# Altium schematic sheet Schematic_Thesis.SchDoc
size A
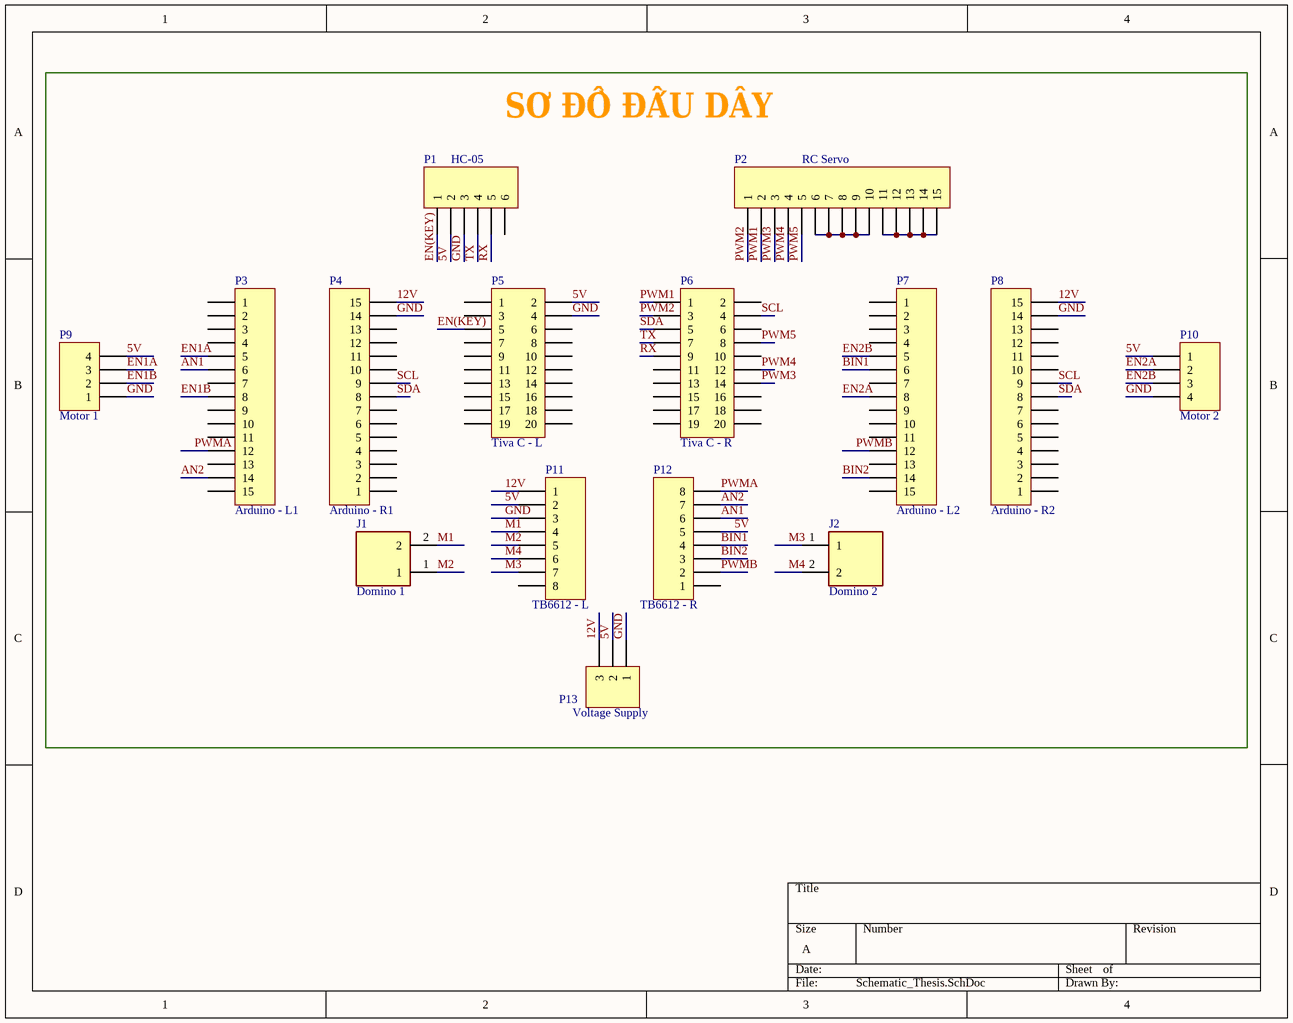
[diagram p0: Schematic_Thesis.SchDoc]

## Parts
J1  Domino 1  [HANDSON_KF301-2P]
J2  Domino 2  [HANDSON_KF301-2P]
P1  HC-05  [HDR1X6]
P2  RC Servo  [HDR1X15]
P3  Arduino - L1  [HDR1X15]
P4  Arduino - R1  [HDR1X15]
P5  Tiva C - L  [HDR2X10]
P6  Tiva C - R  [HDR2X10]
P7  Arduino - L2  [HDR1X15]
P8  Arduino - R2  [HDR1X15]
P9  Motor 1  [HDR1X4]
P10  Motor 2  [HDR1X4]
P11  TB6612 - L  [HDR1X8]
P12  TB6612 - R  [HDR1X8]
P13  Voltage Supply  [HDR1X3]

## Nets
5V: P1.2 P5.2 P9.4 P10.1 P11.2 P12.5 P13.2
12V: P4.15 P8.15 P11.1 P13.3
AN1: P3.6 P12.6
AN2: P3.14 P12.7
BIN1: P7.6 P12.4
BIN2: P7.14 P12.3
EN1A: P3.5 P9.3
EN1B: P3.8 P9.2
EN2A: P7.8 P10.2
EN2B: P7.5 P10.3
EN(KEY): P1.1 P5.5
GND: P1.3 P4.14 P5.4 P8.14 P9.1 P10.4 P11.3 P13.1
M1: J1.2 P11.4
M2: J1.1 P11.5
M3: J2.1 P11.7
M4: J2.2 P11.6
PWM1: P2.2 P6.1
PWM2: P2.1 P6.3
PWM3: P2.3 P6.14
PWM4: P2.4 P6.12
PWM5: P2.5 P6.8
PWMA: P3.12 P12.8
PWMB: P7.12 P12.2
RX: P1.5 P6.9
SCL: P4.9 P6.4 P8.9
SDA: P4.8 P6.5 P8.8
TX: P1.4 P6.7
NetP2_6: P2.6 P2.7 P2.8 P2.9 P2.10
NetP2_11: P2.11 P2.12 P2.13 P2.14 P2.15

Not connected (* = marked no-connect by the designer): P1 6; P3 1 2 3 4 7 9 10 11 13 15; P4 1 2 3 4 5 6 7 10 11 12 13; P5 1 3 6 7 8 9 10 11 12 13 14 15 16 17 18 19 20; P6 2 6 10 11 13 15 16 17 18 19 20; P7 1 2 3 4 7 9 10 11 13 15; P8 1 2 3 4 5 6 7 10 11 12 13; P11 8; P12 1

## Notes on the sheet
- SƠ ĐỒ ĐẤU DÂY

## Library data of the parts
J1 J2 = KF301-2P: 2 Pin Terminal Block 5mm Pitch; MF: Handson Technology; Availability: Unavailable; MP: KF301-2P; Price: None; Value: *; SnapEDA_Link: https://www.snapeda.com/parts/KF301-2P/Handson%20Technology/view-part/4276957/?ref=snap; Package: Package
P1 = Header 6: Header, 6-Pin; LatestRevisionDate: 17-Jul-2002; LatestRevisionNote: Re-released for DXP Platform.; Publisher: Altium Limited
P2-P4 P7 P8 = Header 15: Header, 15-Pin; LatestRevisionDate: 17-Jul-2002; LatestRevisionNote: Re-released for DXP Platform.; Publisher: Altium Limited
P5 P6 = Header 10X2: Header, 10-Pin, Dual row; LatestRevisionDate: 17-Jul-2002; LatestRevisionNote: Re-released for DXP Platform.; Publisher: Altium Limited
P9 P10 = Header 4: Header, 4-Pin; LatestRevisionDate: 17-Jul-2002; LatestRevisionNote: Re-released for DXP Platform.; Publisher: Altium Limited
P11 P12 = Header 8: Header, 8-Pin; LatestRevisionDate: 17-Jul-2002; LatestRevisionNote: Re-released for DXP Platform.; Publisher: Altium Limited
P13 = Header 3: Header, 3-Pin; LatestRevisionDate: 17-Jul-2002; LatestRevisionNote: Re-released for DXP Platform.; Publisher: Altium Limited